# Altium schematic sheet Pressure.SchDoc
size A4
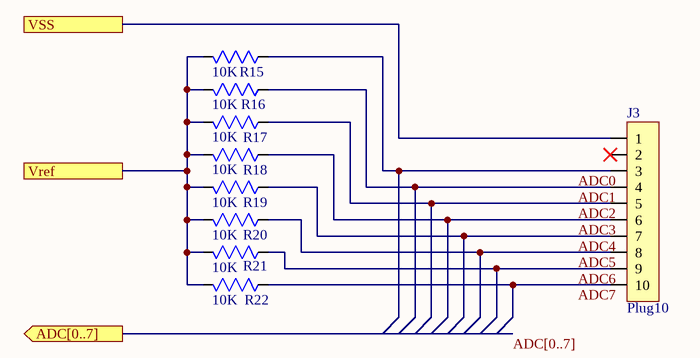
[diagram p0: Pressure.SchDoc]

## Parts
J3  Plug10  [FPC0.5-10PS]
R15  value 10K  [RES_0402]  (hidden comment: Res)
R16  value 10K  [RES_0402]  (hidden comment: Res)
R17  value 10K  [RES_0402]  (hidden comment: Res)
R18  value 10K  [RES_0402]  (hidden comment: Res)
R19  value 10K  [RES_0402]  (hidden comment: Res)
R20  value 10K  [RES_0402]  (hidden comment: Res)
R21  value 10K  [RES_0402]  (hidden comment: Res)
R22  value 10K  [RES_0402]  (hidden comment: Res)

## Ports
ADC[0..7] (out), Vref, VSS

## Nets
ADC0: J3.3 R15.2
ADC1: J3.4 R16.2
ADC2: J3.5 R17.2
ADC3: J3.6 R18.2
ADC4: J3.7 R19.2
ADC5: J3.8 R20.2
ADC6: J3.9 R21.2
ADC7: J3.10 R22.2
Vref: R15.1 R16.1 R17.1 R18.1 R19.1 R20.1 R21.1 R22.1 ; port Vref
VSS: J3.1 ; port VSS

Not connected (* = marked no-connect by the designer): J3 2*

## Buses and harness runs
bus ADC[0..7] = port ADC[0..7]